# Altium schematic sheet mcu_valdis.SchDoc
size A4; SheetNumber: 2; SheetTotal: 2
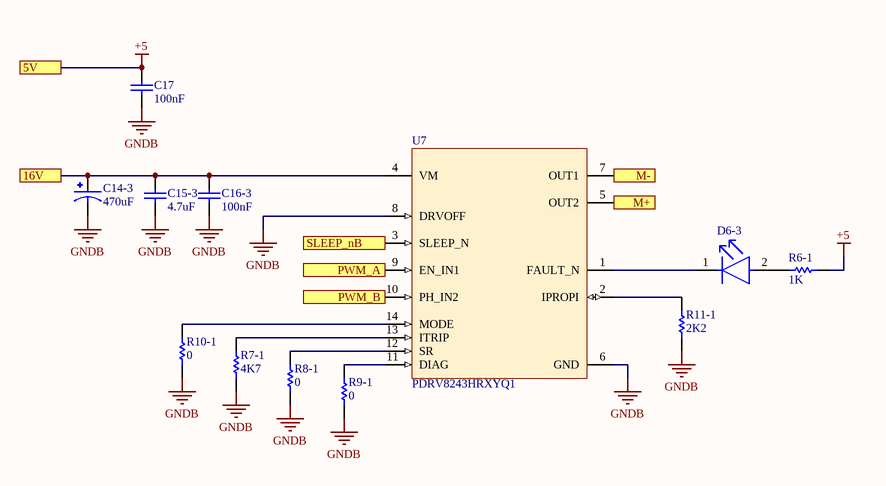
[diagram p0: mcu_valdis.SchDoc]

## Parts
C14-3  470uF  [CAPPRD500W60D800H1500]
C15-3  4.7uF  [CAPC1608X90X35ML10T15]
C16-3  100nF  [CAPC1608X90X35ML10T15]
C17  100nF  [CAPC1608X90X35ML10T15]
D6-3  LTST-C191TBKT  [FP-LTST-C191TBKT-MFG]  (value not drawn)
R6-1  1K  [RESC1609X50X30NL8T20]
R7-1  4K7  [RESC1609X50X30NL8T20]
R8-1  0  [RESC1609X50X30NL8T20]
R9-1  0  [RESC1609X50X30NL8T20]
R10-1  0  [RESC1609X50X30NL8T20]
R11-1  2K2  [RESC1609X50X30NL8T20]
U7  PDRV8243HRXYQ1  [RXY0014A-MFG]

## Ports
5V (see mainboard_valdis[3B]), 16V (see mainboard_valdis[3B]), M+ (out, see mainboard_valdis[4B]), M- (out, see mainboard_valdis[4B]), PWM_A (in, see mainboard_valdis[3B]), PWM_B (in, see mainboard_valdis[3B]), SLEEP_nB (in, see mainboard_valdis[3B])

## Nets
+5: C17.2 R6-1.2 ; port 5V
GNDB: C14-3.N C15-3.1 C16-3.1 C17.1 R7-1.1 R8-1.1 R9-1.1 R10-1.1 R11-1.1 U7.6(GND) U7.8(DRVOFF)
16V: C14-3.P C15-3.2 C16-3.2 U7.4(VM) ; port 16V
M+: U7.5(OUT2) ; port M+
M-: U7.7(OUT1) ; port M-
PWM_A: U7.9(EN_IN1) ; port PWM_A
PWM_B: U7.10(PH_IN2) ; port PWM_B
SLEEP_nB: U7.3(SLEEP_N) ; port SLEEP_nB
NetD6-3_1: D6-3.1(C) U7.1(FAULT_N)
NetD6-3_2: D6-3.2(A) R6-1.1
NetR7-1_2: R7-1.2 U7.13(ITRIP)
NetR8-1_2: R8-1.2 U7.12(SR)
NetR9-1_2: R9-1.2 U7.11(DIAG)
NetR10-1_2: R10-1.2 U7.14(MODE)
NetR11-1_2: R11-1.2 U7.2(IPROPI)

## Library data of the parts
C14-3 = EEUFR1E471YB: 470F 25V Aluminum Electrolytic Capacitors Radial, Can 8000 Hrs @ 105C; MF: Panasonic; Value: *; Price: None; Availability: In Stock; SnapEDA_Link: https://www.snapeda.com/parts/EEUFR1E471YB/Panasonic/view-part/5797024/?ref=snap; Check_prices: https://www.snapeda.com/parts/EEUFR1E471YB/Panasonic/view-part/5797024/?ref=eda; Package: RADIAL-2 Panasonic; MP: EEUFR1E471YB
C15-3 C16-3 C17 = CMP-2000-04945-1: Chip Capacitor, 22 pF, +/- 5%, 50 V, -55 to 125 degC, 0603 (1608 Metric), RoHS, Tape and Reel; Manufacturer: Murata; Capacitance: 22pF; Rated Voltage: 50V; Dielectric: C0G; Manufacturer URL: http://www.murata.com/; Datasheet Version: Jul-06; Package Reference: 603; Tolerance (%): ±5%; Case Size/Dimension: 0603; Package Description: 2-Pin Surface Mount Device, Body 1.6 x 0.8 mm; Datasheet URL: https://datasheet.ciiva.com/11786/0900766b807a1cab-11786398.pdf
D6-3 = CMP-22017-000008-1: LED BLUE CLEAR CHIP SMD; Lens Color: Colorless; Dominant Wavelength: 475nm; Forward Current: 20mA; Wavelength: 468nm; Viewing Angle: 130°; Power Dissipation: 76mW; Luminous Intensity: 180mcd; Reverse Voltage: 5V; Number of Elements: 1; Lens Style: Diffused; Forward Voltage: 3.8V; Max Power Dissipation: 75mW; Case Code (Metric): 1608; Packaging: Tape and Reel; Case/Package: 0603; Depth: 1.6mm; Mount: Surface Mount; Lead Free: Lead Free; Min Operating Temperature: -20°C; Lens Transparency: Clear; Illumination Color: Blue; Height: 0.55mm; Test Current: 20mA; Case Code (Imperial): 0603; Max Operating Temperature: 80°C; Number of Pins: 2; Length: 0.8mm; Radiation Hardening: No; Package Quantity: 1; Number of LEDs: 1; Width: 0.8mm; Color: Blue
R6-1 R7-1 R8-1 R9-1 R10-1 R11-1 = CMP-2000-03816-5: Chip Resistor, 0 Ohm, Jumper, 100 mW, -55 to 155 degC, 0603 (1608 Metric), RoHS, Tape and Reel; Manufacturer: Vishay Semiconductor; Voltage Rating: 75 V; Package Quantity: 5000; DatasheetVersion: 06/2012; Min Operating Temperature: -55 degC; ComponentLink1URL: http://www.vishay.com/; Mounting Technology: Surface Mount; Height: 0.45 mm; ComponentLink1Description: Manufacturer URL; REACH SVHC: Unknown; PackageReference: 0603; Packaging: Tape and Reel; Max Operating Temperature: 155 degC; Mount: Surface Mount; ComponentLink2Description: Datasheet; PackageDescription: 2-Pin Surface Mount Device, Body 1.575 x 0.85 mm; Length: 1.55 mm; ComponentLink2URL: http://www.vishay.com/docs/20035/dcrcwe3.pdf; Pins: 2; RoHSCompliant: true
U7 = PDRV8243HRXYQ1: No Description Available; Mfr_Name: Texas Instruments; Type: DEV; RefDes: RefDes; Copyright: Copyright (C) 2022 Ultra Librarian. All rights reserved.; Manufacturer_Part_Number: PDRV8243HRXYQ1